# Altium schematic sheet rectificador_estimador.SchDoc
size A4
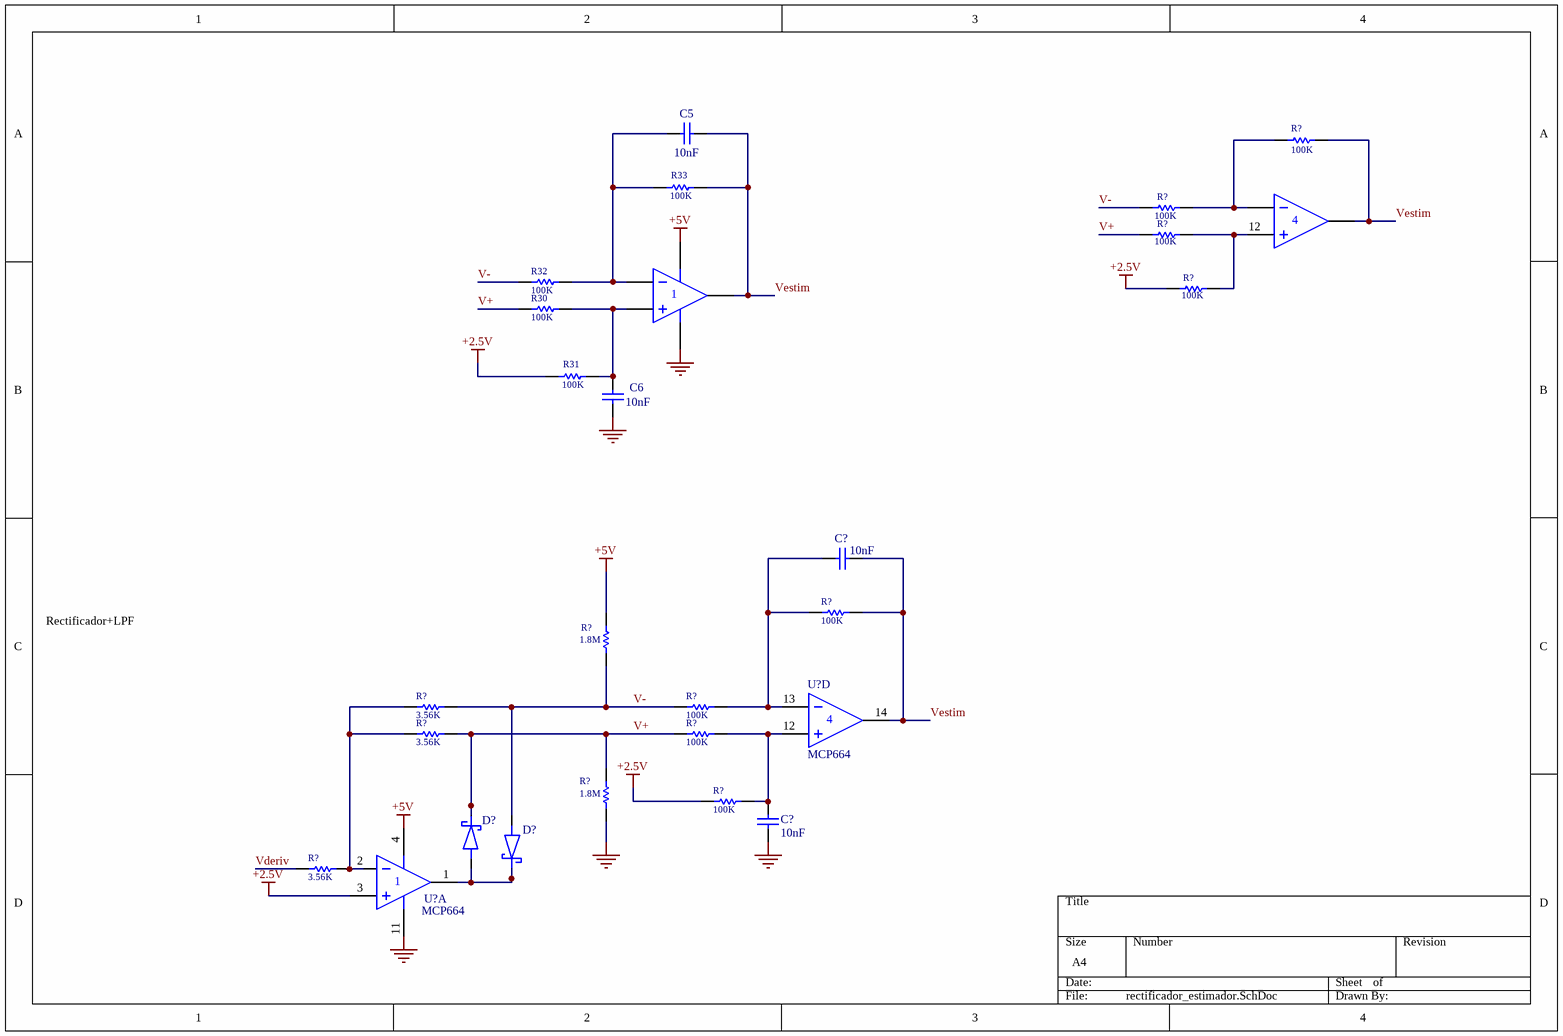
[diagram p0: rectificador_estimador.SchDoc]

## Parts
(Parts that share a designator on the sheet are numbered #1, #2 ... from top to bottom, then left to right.)
C5  value 10nF  [C1206]  (hidden comment: Capacitor)
C6  value 10nF  [C1206]  (hidden comment: Capacitor)
C?#1  value 10nF  [C1206]  (hidden comment: Capacitor)
C?#2  value 10nF  [C1206]  (hidden comment: Capacitor)
D?#1  RSX205LAM30TR  [SODFL4725X105N]  (value not drawn)
D?#2  RSX205LAM30TR  [SODFL4725X105N]  (value not drawn)
R30  100K  [R1206]
R31  100K  [R1206]
R32  100K  [R1206]
R33  100K  [R1206]
R?#1  100K  [R1206]
R?#2  100K  [R1206]
R?#3  100K  [R1206]
R?#4  100K  [R1206]
R?#5  100K  [R1206]
R?#6  1.8M  [R1206]
R?#7  3.56K  [R1206]
R?#8  100K  [R1206]
R?#9  3.56K  [R1206]
R?#10  100K  [R1206]
R?#11  1.8M  [R1206]
R?#12  100K  [R1206]
R?#13  3.56K  [R1206]
U1  MCP664  [SOIC14]  (value not drawn)  (part A of 4)
U?#1  MCP664  [SOIC14]  (value not drawn)  (part D of 4)
U?#2  MCP664  [SOIC14]  (part D of 4)
U?#3  MCP664  [SOIC14]  (part A of 4)

## Nets
+2.5V: R31.2 R?#4.2 R?#12.2 U?#3.3(IN+)
+5V: R?#6.2 U1.4(V+) U?#3.4(V+)
GND: C6.1 C?#2.1 R?#11.1 U1.11(V-) U?#3.11(V-)
V+: D?#1.1(K) R30.1 R?#3.1 R?#9.2 R?#10.1 R?#11.2
V-: D?#2.2(A) R32.1 R?#2.1 R?#6.1 R?#7.2 R?#8.1
Vderiv: R?#13.1
Vestim: C5.1 C?#1.1 R33.1 R?#1.1 R?#5.1 U1.1(OUT) U?#1.14(OUT) U?#2.14(OUT)
NetC5_2: C5.2 R32.2 R33.2 U1.2(IN-)
NetC6_2: C6.2 R30.2 R31.1 U1.3(IN+)
NetC?#1_2: C?#1.2 R?#5.2 R?#8.2 U?#2.13(IN-)
NetC?#2_2: C?#2.2 R?#10.2 R?#12.1 U?#2.12(IN+)
NetD?#1_2: D?#1.2(A) D?#2.1(K) U?#3.1(OUT)
NetR?#1_2: R?#1.2 R?#2.2 U?#1.13(IN-)
NetR?#3_2: R?#3.2 R?#4.1 U?#1.12(IN+)
NetR?#7_1: R?#7.1 R?#9.1 R?#13.2 U?#3.2(IN-)

## Notes on the sheet
- Rectificador+LPF

## Library data of the parts
C5 C6 C?#1 C?#2 = Capacitor: CAP CER 10000PF 500V X7R 1206; Manufacturer: KEMET; Mfr PN: C1206C103KCRAC7800; Supplier 1: Digi-Key; Supplier 1 PN: 399-C1206C103KCRAC7800CT-ND
D?#1 D?#2 = RSX205LAM30TR: DIODE SCHOTTKY 30V 2A PMDTM; Manufacturer: ROHM Semiconductor; Mfr PN: RSX205LAM30TR; Supplier 1: Digi-Key; Supplier 1 PN: RSX205LAM30CT-ND
R30-R33 R?#1-R?#5 R?#8 R?#10 R?#12 = R1206: RES 100K OHM 1% 1/4W 1206; Mfr PN: RMCF1206FT100K; Manufacturer: Stackpole Electronics Inc; Supplier 1 PN: RMCF1206FT100KCT-ND; Supplier 1: Digi-Key; Value: 100K; Tolerance: 1%
R?#6 R?#11 = R1206: RES 1.8M OHM 1% 1/4W 1206; Mfr PN: RC1206FR-071M8L; Manufacturer: YAGEO; Supplier 1 PN: 311-1.80MFRCT-ND; Supplier 1: Digi-Key; Value: 1.8M; Tolerance: 1%
R?#7 R?#9 R?#13 = R1206: RES 3.57K OHM 1% 1/4W 1206; Mfr PN: RC1206FR-073K57L; Manufacturer: YAGEO; Supplier 1 PN: 311-3.57KFRCT-ND; Supplier 1: Digi-Key; Value: 3.56K; Tolerance: 1%
U1 U?#1-U?#3 = MCP664: IC OPAMP GP 4 CIRCUIT 14TSSOP; Mfr PN: MCP664-E/ST; Manufacturer: Microchip Technology; Datasheet: https://ar.mouser.com/datasheet/2/268/20002194E-2448650.pdf; Supplier 1: Digi-Key; Supplier 1 PN: MCP664-E/ST-ND